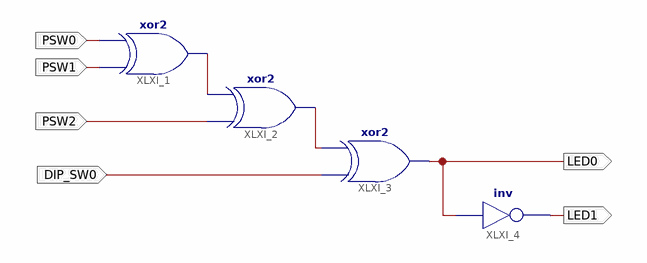
[diagram p0: schematic sheet 1]
// Xilinx ISE schematic lab4_xor3.sch (spartan3) as structural Verilog: 4 symbols, 6 ports
module lab4_xor3 (
  input  PSW0,
  input  PSW1,
  input  PSW2,
  input  DIP_SW0,
  output LED0,
  output LED1
);

  wire XLXN_1, XLXN_2;

  xor XLXI_1 (XLXN_1, PSW1, PSW0);
  xor XLXI_2 (XLXN_2, PSW2, XLXN_1);
  xor XLXI_3 (LED0, DIP_SW0, XLXN_2);
  not XLXI_4 (LED1, LED0);
endmodule
